# EAGLE design ICM30630_breakout (EAGLE 7.4.0)
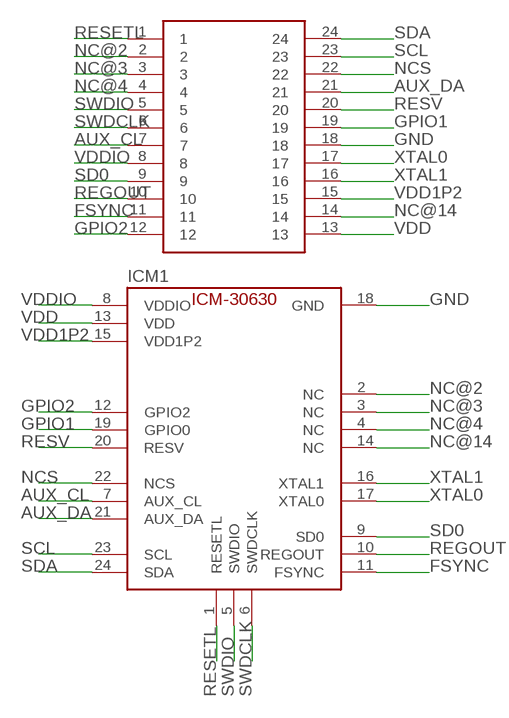
[diagram p0: schematic, sheet 1]

## Parts
ICM1  IS-ICM30630  [LGA-24]
U$1  24PIN  [24PIN-WIDE]

## Nets
AUX_CL: ICM1.7(AUX_CL) U$1.7
AUX_DA: ICM1.21(AUX_DA) U$1.21
FSYNC: ICM1.11(FSYNC) U$1.11
GND: ICM1.18(GND) U$1.18
GPIO1: ICM1.19(GPIO0) U$1.19
GPIO2: ICM1.12(GPIO2) U$1.12
NC@2: ICM1.2(NC) U$1.2
NC@3: ICM1.3(NC) U$1.3
NC@4: ICM1.4(NC) U$1.4
NC@14: ICM1.14(NC) U$1.14
NCS: ICM1.22(NCS) U$1.22
REGOUT: ICM1.10(REGOUT) U$1.10
RESETL: ICM1.1(RESETL) U$1.1
RESV: ICM1.20(RESV) U$1.20
SCL: ICM1.23(SCL) U$1.23
SD0: ICM1.9(SD0) U$1.9
SDA: ICM1.24(SDA) U$1.24
SWDCLK: ICM1.6(SWDCLK) U$1.6
SWDIO: ICM1.5(SWDIO) U$1.5
VDD: ICM1.13(VDD) U$1.13
VDD1P2: ICM1.15(VDD1P2) U$1.15
VDDIO: ICM1.8(VDDIO) U$1.8
XTAL0: ICM1.17(XTAL0) U$1.17
XTAL1: ICM1.16(XTAL1) U$1.16

## Library data of the parts
ICM1 = FaBo-Mems:IS-ICM30630
U$1 = FaBo-Breakout:24PIN

## Board
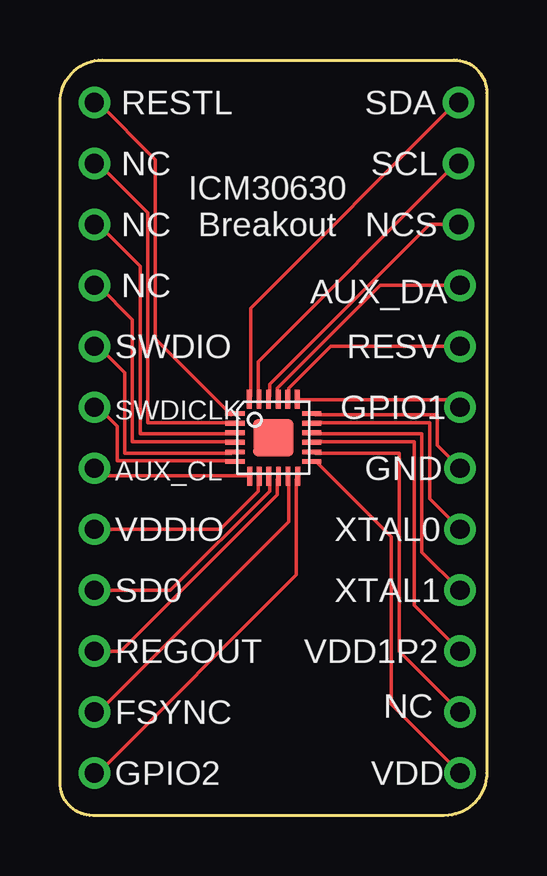
[diagram p1: board, top side]

Size 17.78 x 31.48 mm. Coordinates in mm from the lower left corner, seen from the top.
Copper layers (1*16): Top 0.035mm / dielectric 1.5mm / Bottom 0.035mm
Design rules "SeeedStudio_2layer_DRU_no_angle_20140221 *": minimum track width 6mil, minimum drill 12mil, track to track 5.5mil, track to pad 6mil, pad to pad 6mil, via to via 6mil, smd to smd 0mil, copper to edge 10mil, drill to drill 10mil, minimum pad ring 10mil, minimum via ring 6mil, stop-mask expansion 2mil, vias tented up to drill 100mil, thermal gap 10mil

### Footprints (pad centres in the part's own frame; a part is rotated, then mirrored left to right if it is on the bottom)
LGA-24 = smd 0.8 x 0.2: 1 -1.6,1.01; 2 -1.6,0.61; 3 -1.6,0.21; 4 -1.6,-0.19; 5 -1.6,-0.59; 6 -1.6,-0.99; 13 1.6,-0.99; 14 1.6,-0.59; 15 1.6,-0.19; 16 1.6,0.21; 17 1.6,0.61; 18 1.6,1.01 | smd 0.2 x 0.8: 7 -0.99,-1.6; 8 -0.59,-1.6; 9 -0.19,-1.6; 10 0.21,-1.6; 11 0.61,-1.6; 12 1.01,-1.6; 19 1,1.6; 20 0.6,1.6; 21 0.2,1.6; 22 -0.2,1.6; 23 -0.6,1.6; 24 -1,1.6 | smd 1.7 x 1.55: 25 0,0
24PIN-WIDE = drill 0.8: 1 -7.46,7.62; 2 -7.46,5.08; 3 -7.46,2.54; 4 -7.46,0; 5 -7.46,-2.54; 6 -7.46,-5.08; 7 -7.46,-7.62; 8 -7.46,-10.16; 9 -7.46,-12.7; 10 -7.46,-15.24; 11 -7.46,-17.78; 12 -7.46,-20.32; 13 7.78,-20.32; 14 7.78,-17.78; 15 7.78,-15.24; 16 7.78,-12.7; 17 7.78,-10.16; 18 7.78,-7.62; 19 7.78,-5.08; 20 7.78,-2.54; 21 7.78,0; 22 7.72,2.54; 23 7.72,5.08; 24 7.72,7.62

### Placement (x,y rotation side)
ICM1  8.89,15.74 0 top
U$1  8.89,22.09 0 top

### Tracks (layer width: path | path; a pad name or v marks a point on that pad's centre or on a via)
AUX_CL
  Top 0.152: ICM1.7 7.94,14.15 1.59,14.15 1.59,14.47 U$1.7
AUX_DA
  Top 0.152: U$1.21 13.34,22.09 9.05,17.8 9.05,17.49 ICM1.21
FSYNC
  Top 0.152: ICM1.11 9.53,13.99 9.53,12.25 1.59,4.31 U$1.11
GND
  Top 0.152: ICM1.18 10.64,16.69 15.72,16.69 15.72,15.42 U$1.18
GPIO1
  Top 0.152: ICM1.19 9.84,17.33 16.67,17.33 U$1.19
GPIO2
  Top 0.152: ICM1.12 9.84,13.99 9.84,10.03 1.59,1.77 U$1.12
NC@2
  Top 0.152: ICM1.2 7.14,16.38 3.65,16.38 3.65,25.11 1.59,27.17 U$1.2
NC@3
  Top 0.152: ICM1.3 7.14,15.9 3.33,15.9 3.33,22.88 1.59,24.63 U$1.3
NC@4
  Top 0.152: ICM1.4 7.14,15.58 3.02,15.58 3.02,20.66 1.59,22.09 U$1.4
NC@14
  Top 0.152: ICM1.14 10.64,15.11 14.13,15.11 14.13,6.85 U$1.14
NCS
  Top 0.152: U$1.22 15.4,24.63 8.73,17.96 8.73,17.49 ICM1.22
REGOUT
  Top 0.152: U$1.10 2.54,6.85 9.05,13.36 9.05,13.99 ICM1.10
RESETL
  Top 0.152: ICM1.1 7.14,16.69 3.97,19.87 3.97,27.33 1.59,29.71 U$1.1
RESV
  Top 0.152: U$1.20 11.27,19.55 9.53,17.8 9.53,17.49 ICM1.20
SCL
  Top 0.152: ICM1.23 8.26,17.49 8.26,18.91 16.51,27.17 U$1.23
SD0
  Top 0.152: U$1.9 4.6,9.39 8.73,13.52 8.73,13.99 ICM1.9
SDA
  Top 0.152: ICM1.24 7.94,17.49 7.94,21.14 16.51,29.71 U$1.24
SWDCLK
  Top 0.152: ICM1.6 7.14,14.79 2.38,14.79 2.38,16.22 1.59,17.01 U$1.6
SWDIO
  Top 0.152: ICM1.5 7.14,15.11 2.7,15.11 2.7,18.44 1.59,19.55 U$1.5
VDD
  Top 0.152: ICM1.13 10.64,14.79 13.81,11.61 13.81,4.63 U$1.13
VDD1P2
  Top 0.152: ICM1.15 10.64,15.58 14.76,15.58 14.76,8.76 U$1.15
VDDIO
  Top 0.152: U$1.8 6.67,11.93 8.26,13.52 8.26,13.99 ICM1.8
XTAL0
  Top 0.152: ICM1.17 10.64,16.38 15.4,16.38 15.4,13.2 U$1.17
XTAL1
  Top 0.152: ICM1.16 10.64,15.9 15.08,15.9 15.08,10.98 U$1.16

### Text on the board
tPlace: RESTL | SDA | NC | ICM30630 / Breakout | SCL | NC | NCS | NC | AUX_DA | SWDIO | RESV | SWDICLK | GPIO1 | AUX_CL | GND | VDDIO | XTAL0 | SD0 | XTAL1 | REGOUT | VDD1P2 | FSYNC | NC | GPIO2 | VDD